# Altium schematic sheet Burn_Wires.SchDoc
size 297 x 210 mm
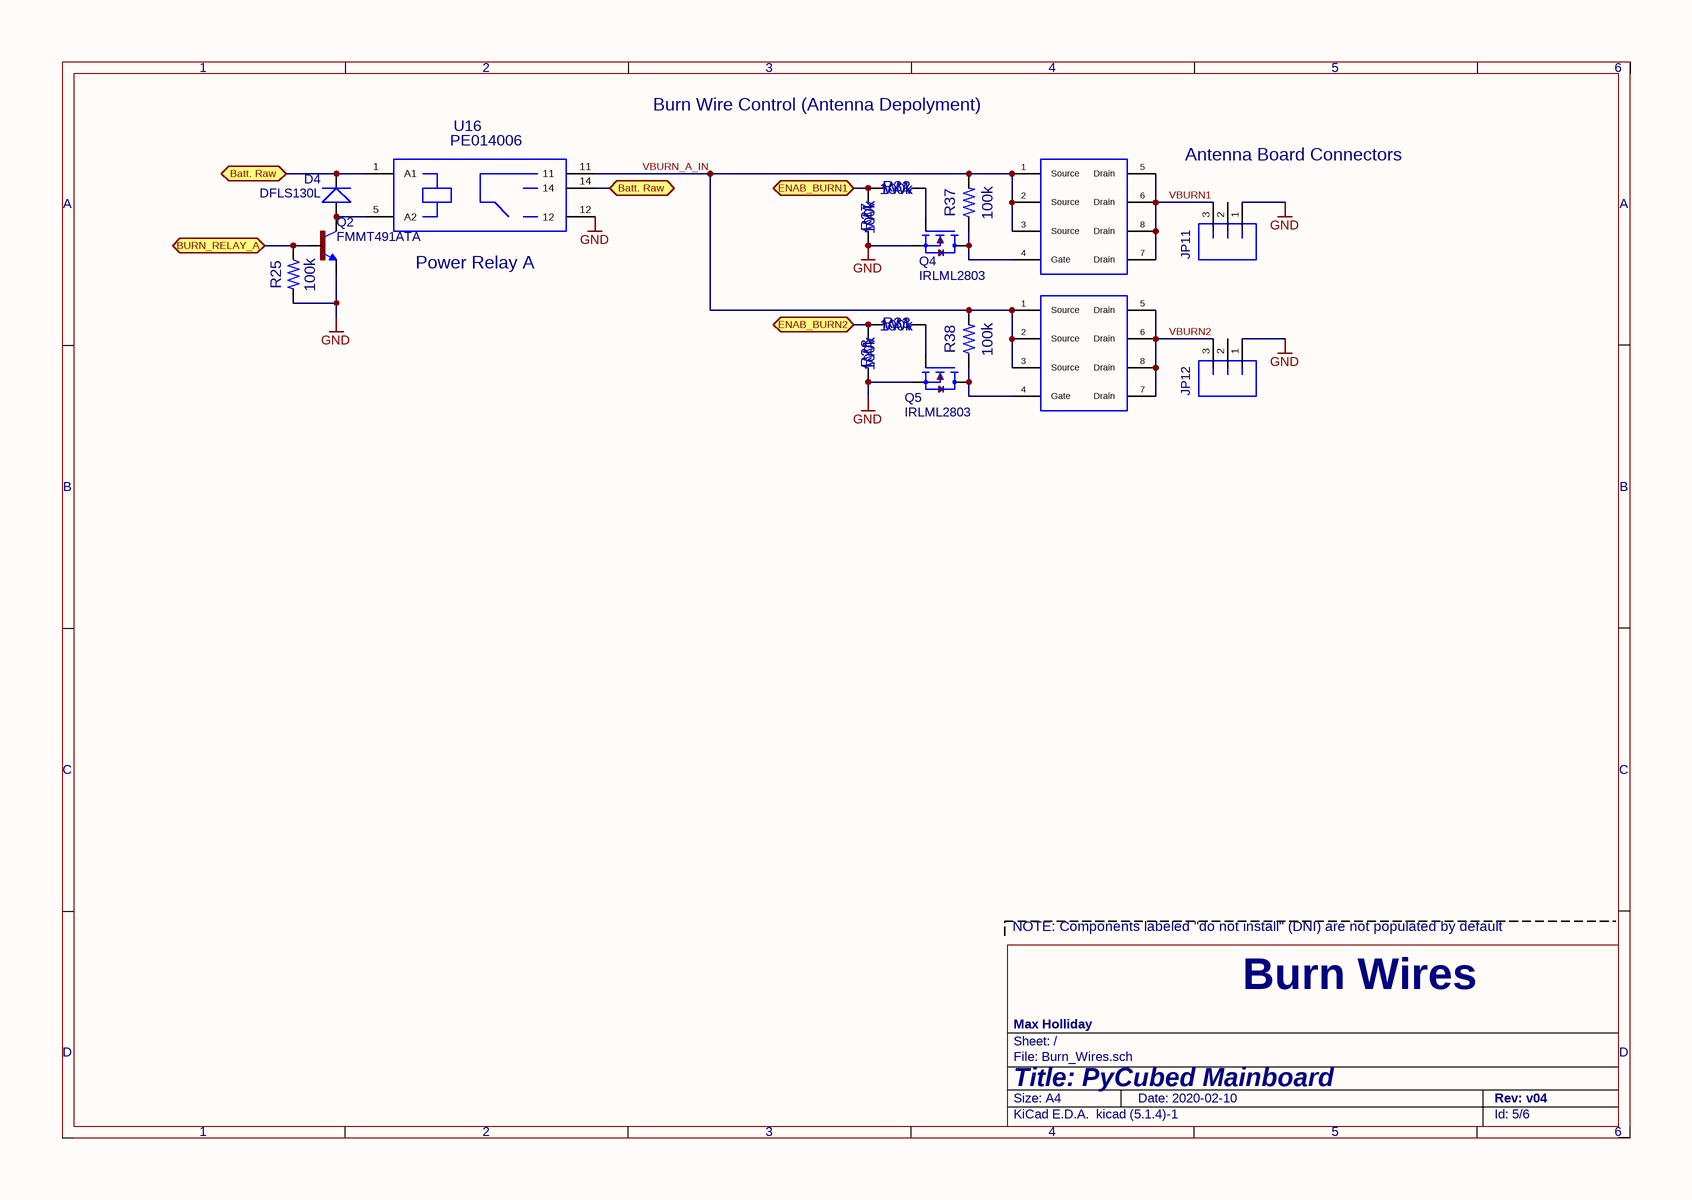
[diagram p0: Burn_Wires.SchDoc]

## Parts
D4  value DFLS130L  [PWRDI-123]  (hidden comment: SBR2A40P1Q-7)
JP11  Conn_01x03  [MOLEX-1X3_LOCK]  (value not drawn)
JP12  Conn_01x03  [MOLEX-1X3_LOCK]  (value not drawn)
Q2  FMMT491ATA  [SOT23]
Q4  IRLML2803  [SOT-23]
Q5  IRLML2803  [SOT-23]
R25  100k  [R_0603_1608Metric]
R27  100k  [R_0603_1608Metric]
R28  100k  [R_0603_1608Metric]
R32  100k  [R_0603_1608Metric]
R33  100k  [R_0603_1608Metric]
R37  100k  [R_0603_1608Metric]
R38  100k  [R_0603_1608Metric]
U16  PE014006  [RELAY5-PE_CO]
U18  NDS8434  [NDS8434]  (value not drawn)
U19  NDS8434  [NDS8434]  (value not drawn)

## Ports
Batt. Raw (bidir), BURN_RELAY_A (bidir), ENAB_BURN1 (bidir), ENAB_BURN2 (bidir)

## Nets
GND: JP11.1 JP12.1 Q2.2(E) Q4.2(S) Q5.2(S) R25.2 R27.2 R28.2 U16.12
Batt. Raw: D4.C U16.1(A1) U16.14 ; port Batt. Raw
BURN_RELAY_A: Q2.1(B) R25.1 ; port BURN_RELAY_A
ENAB_BURN1: R27.1 R32.2 ; port ENAB_BURN1
ENAB_BURN2: R28.1 R33.2 ; port ENAB_BURN2
VBURN1: JP11.3 U18.5(Drain) U18.6(Drain) U18.7(Drain) U18.8(Drain)
VBURN2: JP12.3 U19.5(Drain) U19.6(Drain) U19.7(Drain) U19.8(Drain)
VBURN_A_IN: R37.2 R38.2 U16.11 U18.1(Source) U18.2(Source) U18.3(Source) U19.1(Source) U19.2(Source) U19.3(Source)
NetD4_A: D4.A Q2.3(C) U16.5(A2)
NetQ4_1: Q4.1(G) R32.1
NetQ4_3: Q4.3(D) R37.1 U18.4(Gate)
NetQ5_1: Q5.1(G) R33.1
NetQ5_3: Q5.3(D) R38.1 U19.4(Gate)

Not connected (* = marked no-connect by the designer): JP11 2; JP12 2

## Notes on the sheet
- Burn Wire Control (Antenna Depolyment)
- Antenna Board
  Connectors
- (near U16) Power Relay A
- NOTE: Components labeled "do not install" (DNI) are not populated by default
- Burn Wires
- 1
- 2
- 3
- 4
- 5
- 6
- A
- B
- C
- D
- Title: PyCubed Mainboard
- File: Burn_Wires.sch
- Sheet: /
- Max Holliday
- KiCad E.D.A.  kicad (5.1.4)-1
- Size: A4
- Date: 2020-02-10
- Rev: v04
- Id: 5/6

## Library data of the parts
D4 = DFLS130L: Proto: DFLS130L; Footprint: mainboard:PWRDI-123; MPN: DFLS130L
JP11 JP12 = M03POLAR_LOCK: Value: Conn_01x03; Footprint: mainboard:MOLEX-1X3_LOCK
Q2 = BC846: Proto: S8050; Value: FMMT491ATA; Footprint: mainboard:SOT23; MPN: FMMT491ATA
Q4 Q5 = IRLML2803TRPBF: Proto: 2302; Value: IRLML2803; Footprint: mainboard:SOT-23; MPN: IRLML2803
R25 R27 R28 R32 R33 R37 R38 = RESISTOR0603: MPN: RC0603JR-07100KL; Value: 100k; Footprint: Resistor_SMD:R_0603_1608Metric
U16 = PE014005: MPN: PE014006 TE; Proto: JE-109D GOODSKY; Value: PE014006; Footprint: mainboard:RELAY5-PE_CO
U18 U19 = NDS8434: MPN: IRF7404TRPBF; Proto: DMP2022LSS-13; Value: NDS8434; Footprint: custom-footprints:NDS8434